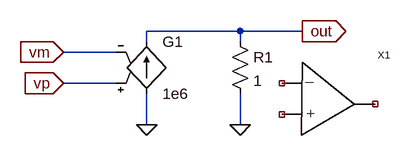
[diagram p0: schematic opamp.asc]
opamp.asc, the LTspice schematic file:
Version 4
SHEET 1 880 680
WIRE 336 112 192 112
WIRE 432 112 336 112
WIRE 192 128 192 112
WIRE 336 128 336 112
WIRE 144 144 64 144
WIRE 144 192 64 192
WIRE 192 256 192 208
WIRE 336 256 336 208
FLAG 192 256 0
FLAG 336 256 0
FLAG 64 144 vm
IOPIN 64 144 In
FLAG 64 192 vp
IOPIN 64 192 In
FLAG 432 112 out
IOPIN 432 112 Out
SYMBOL g2 192 112 R0
SYMATTR InstName G1
SYMATTR Value 1e6
SYMBOL res 320 112 R0
SYMATTR InstName R1
SYMATTR Value 1
SYMBOL opamp 432 224 R0
SYMATTR InstName X1

The netlist it stands for:
* opamp.asc
G1 0 out vp vm 1e6
R1 out 0 1
XX1 NC_01 NC_02 NC_03 opamp  ; pins vm vp out
.backanno
.end